# EAGLE design power_pcb (EAGLE 7.5.0)
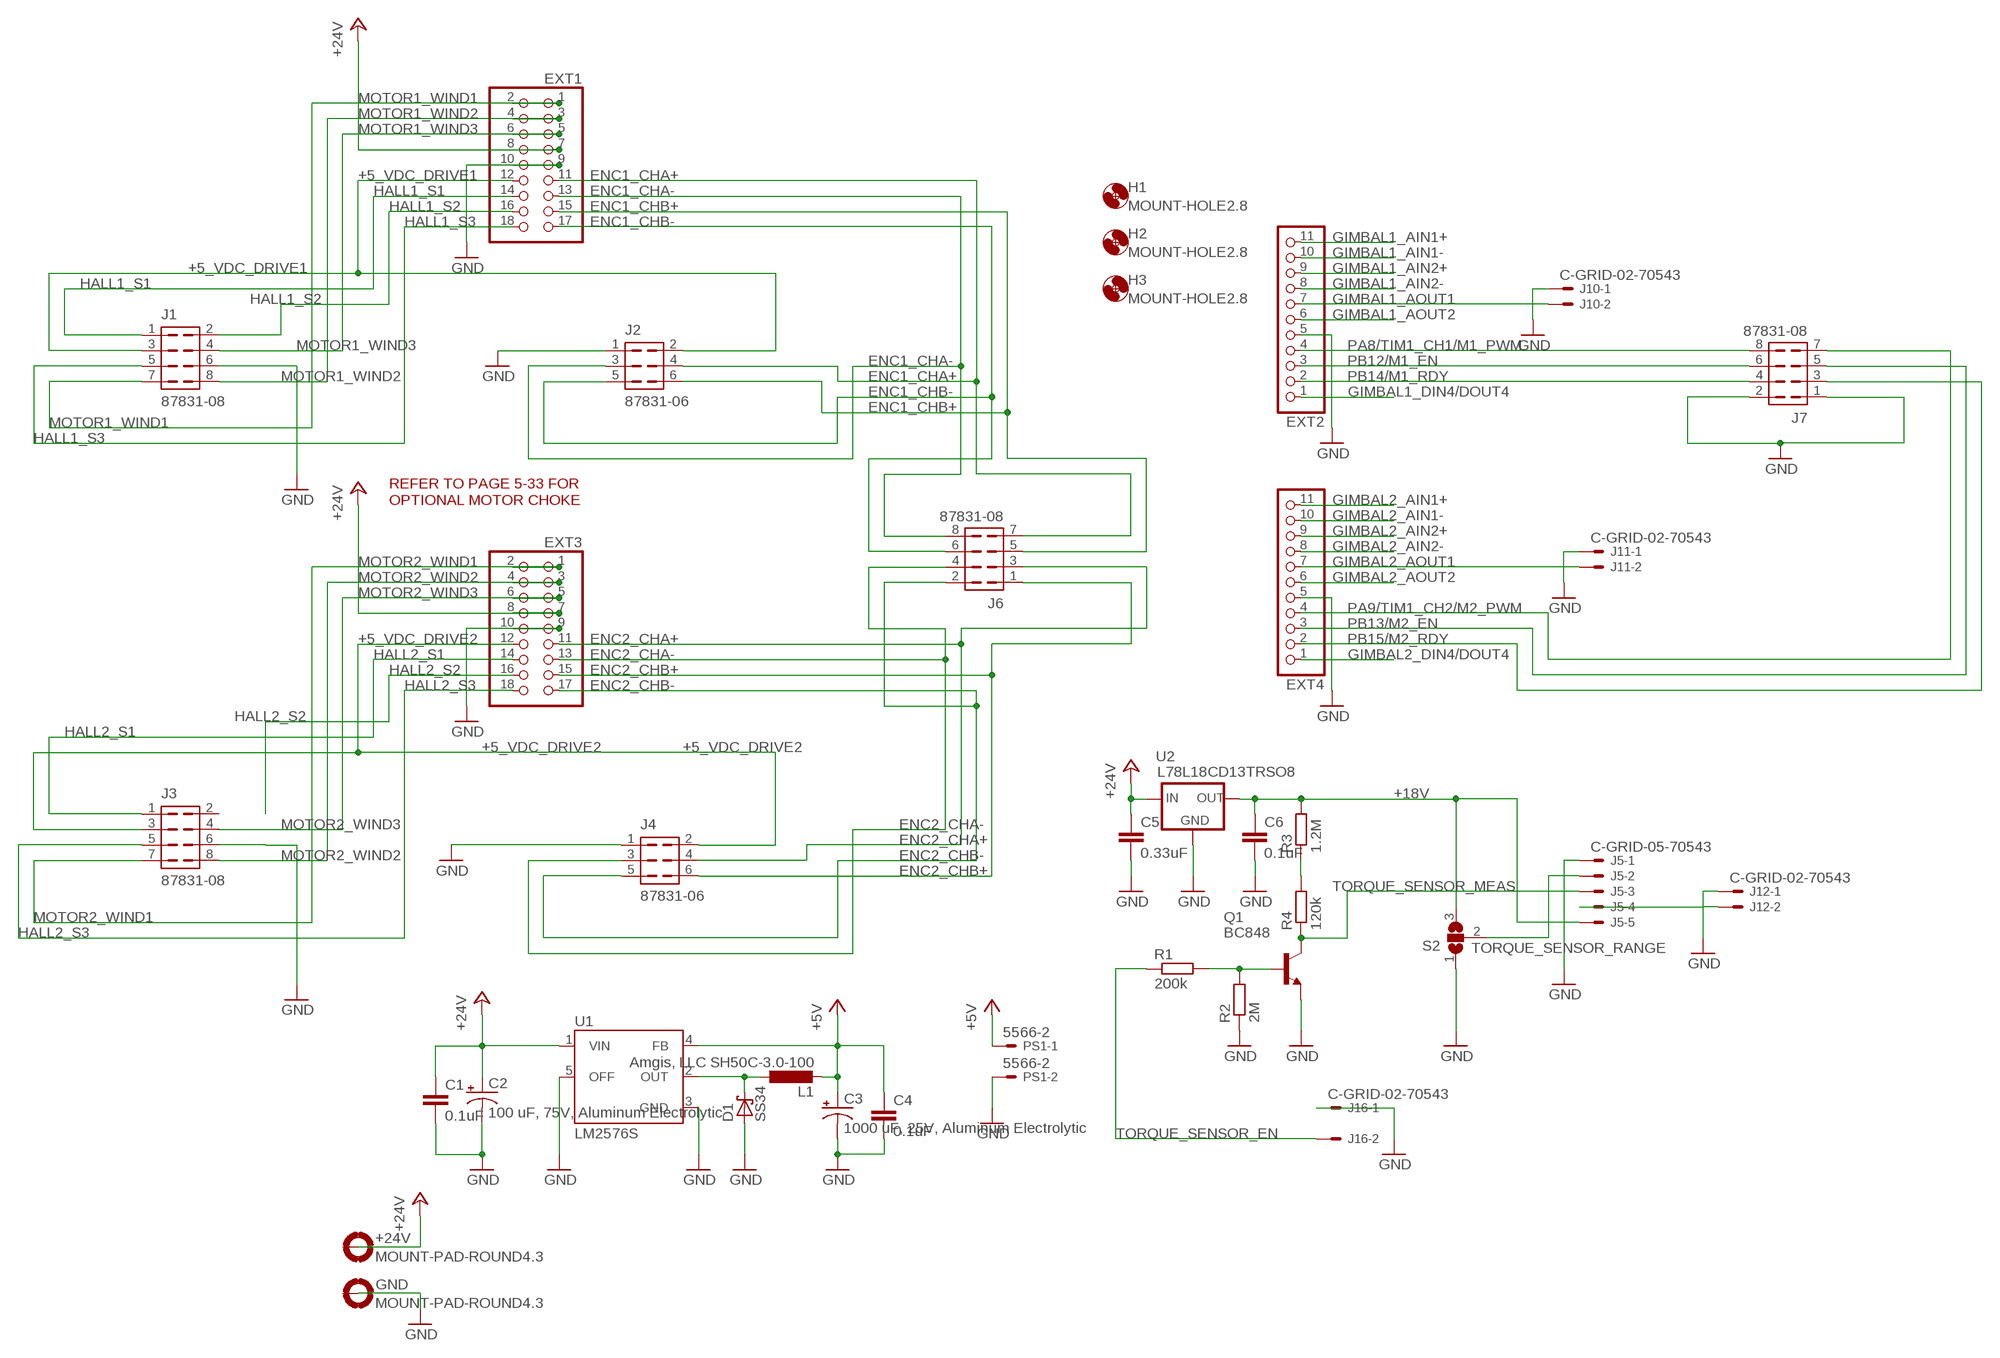
[diagram p0: schematic, sheet 1]

## Parts
+24V  MOUNT-PAD-ROUND4.3  [4,3-PAD]
C1  0.1uF  C-EUC0603  [C0603]
C2  100 uF, 75V, Aluminum Electrolytic  CAP_POLH13  [PANASONIC_H13]
C3  1000 uF, 25V, Aluminum Electrolytic  CAP_POLH13  [PANASONIC_H13]
C4  0.1uF  C-EUC0603  [C0603]
C5  0.33uF  C-EUC0603  [C0603]
C6  0.1uF  C-EUC0603  [C0603]
D1  SS34  SCHOTTKY-DIODESMC  [SMC]
EXT1  PINHD-2X9  [2X09]
EXT2  PINHD-1X11  [1X11]
EXT3  PINHD-2X9  [2X09]
EXT4  PINHD-1X11  [1X11]
GND  MOUNT-PAD-ROUND4.3  [4,3-PAD]
H1  MOUNT-HOLE2.8  [2,8]
H2  MOUNT-HOLE2.8  [2,8]
H3  MOUNT-HOLE2.8  [2,8]
J1  87831-08  [87831-08]
J2  87831-06  [87831-06]
J3  87831-08  [87831-08]
J4  87831-06  [87831-06]
J5  C-GRID-05-70543  [70543-05]
J6  87831-08  [87831-08]
J7  87831-08  [87831-08]
J10  C-GRID-02-70543  [70543-02]
J11  C-GRID-02-70543  [70543-02]
J12  C-GRID-02-70543  [70543-02]
J16  C-GRID-02-70543  [70543-02]
L1  Amgis, LLC SH50C-3.0-100  SH50CC4  [SH50C-C4]
PS1  5566-2  [5566-2]
Q1  BC848  [SOT23]
R1  200k  R-EU_R0603  [R0603]
R2  2M  R-EU_R0603  [R0603]
R3  1.2M  R-EU_R1210  [R1210]
R4  120k  R-EU_R1210  [R1210]
S2  SJ2W  [SJ_2]
U1  LM2576S  [TO263-5]
U2  L78L18CD13TRSO8  [SO8-VREG]

## Nets
+5_VDC_DRIVE1: EXT1.12 J1.3 J2.2
+5_VDC_DRIVE2: EXT3.12 J3.3 J4.2
+5V: C3.+ C4.1 L1.P$2 PS1.1 U1.4(FB)
+18V: C6.1 J5.5 R3.2 S2.3 U2.1(OUT)
+24V: C1.1 C2.+ C5.1 EXT1.7 EXT1.8 EXT3.7 EXT3.8 U1.1(VIN) U2.8(IN)
ENC1_CHA+: EXT1.11 J2.4 J6.7
ENC1_CHA-: EXT1.13 J2.3 J6.8
ENC1_CHB+: EXT1.15 J2.6 J6.5
ENC1_CHB-: EXT1.17 J2.5 J6.6
ENC2_CHA+: EXT3.11 J4.4 J6.3
ENC2_CHA-: EXT3.13 J4.3 J6.4
ENC2_CHB+: EXT3.15 J4.6 J6.1
ENC2_CHB-: EXT3.17 J4.5 J6.2
GIMBAL1_AIN1+: EXT2.11
GIMBAL1_AIN1-: EXT2.10
GIMBAL1_AIN2+: EXT2.9
GIMBAL1_AIN2-: EXT2.8
GIMBAL1_AOUT1: EXT2.7 J10.2
GIMBAL1_AOUT2: EXT2.6
GIMBAL1_DIN4/DOUT4: EXT2.1
GIMBAL2_AIN1+: EXT4.11
GIMBAL2_AIN1-: EXT4.10
GIMBAL2_AIN2+: EXT4.9
GIMBAL2_AIN2-: EXT4.8
GIMBAL2_AOUT1: EXT4.7 J11.2
GIMBAL2_AOUT2: EXT4.6
GIMBAL2_DIN4/DOUT4: EXT4.1
GND: C1.2 C2.- C3.- C4.2 C5.2 C6.2 D1.A EXT1.9 EXT1.10 EXT2.5 EXT3.9 EXT3.10 EXT4.5 J1.6 J2.1 J3.6 J4.1 J5.1 J7.1 J7.2 J10.1 J11.1 J12.1 J16.1 PS1.2 Q1.2(E) R2.1 S2.1 U1.3(GND) U1.5(OFF) U2.2(GND) U2.3(GND) U2.6(GND) U2.7(GND)
HALL1_S1: EXT1.14 J1.1
HALL1_S2: EXT1.16 J1.2
HALL1_S3: EXT1.18 J1.5
HALL2_S1: EXT3.14 J3.1
HALL2_S2: EXT3.16
HALL2_S3: EXT3.18 J3.5
MOTOR1_WIND1: EXT1.1 EXT1.2 J1.7
MOTOR1_WIND2: EXT1.3 EXT1.4 J1.8
MOTOR1_WIND3: EXT1.5 EXT1.6 J1.4
MOTOR2_WIND1: EXT3.1 EXT3.2 J3.7
MOTOR2_WIND2: EXT3.3 EXT3.4 J3.8
MOTOR2_WIND3: EXT3.5 EXT3.6 J3.4
N$1: J5.4 J12.2
N$30: D1.C L1.P$1 U1.2(OUT)
N$52: R3.1 R4.2
N$54: Q1.1(B) R1.2 R2.2
PA8/TIM1_CH1/M1_PWM: EXT2.4 J7.8
PA9/TIM1_CH2/M2_PWM: EXT4.4 J7.7
PB12/M1_EN: EXT2.3 J7.6
PB13/M2_EN: EXT4.3 J7.5
PB14/M1_RDY: EXT2.2 J7.4
PB15/M2_RDY: EXT4.2 J7.3
TORQUE_SENSOR_EN: J16.2 R1.1
TORQUE_SENSOR_MEAS: J5.3 Q1.3(C) R4.1
TORQUE_SENSOR_RANGE: J5.2 S2.2
Unconnected: +24V.B4,3(MOUNT) GND.B4,3(MOUNT) J3.2

## Notes on the sheet
- REFER TO PAGE 5-33 FOR
  OPTIONAL MOTOR CHOKE

## Library data of the parts
+24V GND = holes:MOUNT-PAD-ROUND: MOUNTING PAD, round
C1 C4-C6 = rcl:C-EU: CAPACITOR, European symbol
C2 C3 = SparkFun-Capacitors:CAP_POL: Capacitor Polarized These are standard SMD and PTH capacitors. Normally 10uF, 47uF, and 100uF in electrolytic and tantalum varieties. Always verify the external diameter of the through hole cap, it varies with capacity, voltage, and manufacturer. The EIA devices should be standard.
D1 = diode:SCHOTTKY-DIODE: Schottky Diode
EXT1 EXT3 = pinhead:PINHD-2X9: PIN HEADER
EXT2 EXT4 = pinhead:PINHD-1X11: PIN HEADER
H1-H3 = holes:MOUNT-HOLE: MOUNTING HOLE with drill center marker
J1 J3 J6 J7 = components:87831-08: Milli-Grid Header 2.00mm (.079") Pitch; OC_FARNELL: unknown; OC_NEWARK: unknown
J2 J4 = components:87831-06: Milli-Grid Header 2.00mm (.079") Pitch; OC_FARNELL: 1756947; OC_NEWARK: unknown
J5 = con-molex:C-GRID-05: CONNECTOR wire to board 2.54 mm (0.100") pitch header; OC_FARNELL: unknown; OC_NEWARK: unknown
J10-J12 J16 = con-molex:C-GRID-02: CONNECTOR wire to board 2.54 mm (0.100") pitch header; OC_FARNELL: unknown; OC_NEWARK: unknown
L1 = components:SH50C: Amgis SH50 Fixed Inductor Toroidal Powdered Iron Core
PS1 = con-molex:5566-2: Mini FIT connector 2 pol Source: http://www.molex.com; OC_FARNELL: 1822072; OC_NEWARK: unknown
Q1 = transistor:BC848: NPN TRANSISTOR
R1-R4 = rcl:R-EU_: RESISTOR, European symbol
S2 = jumper:SJ2W: SMD solder JUMPER
U1 = v-reg-3:LM2576: National Semiconductor <http://www.national.com> 3.0A "Simple Switcher"(c) 52kHz, Vout 1.23-37V (HV: 57V), Vin 40V (HV: 60V), 50µA standby current
U2 = components:L78L18CD13TR: VOLTAGE REGULATOR http://www.mouser.com/ds/2/389/CD00000446-355303.pdf

## Board
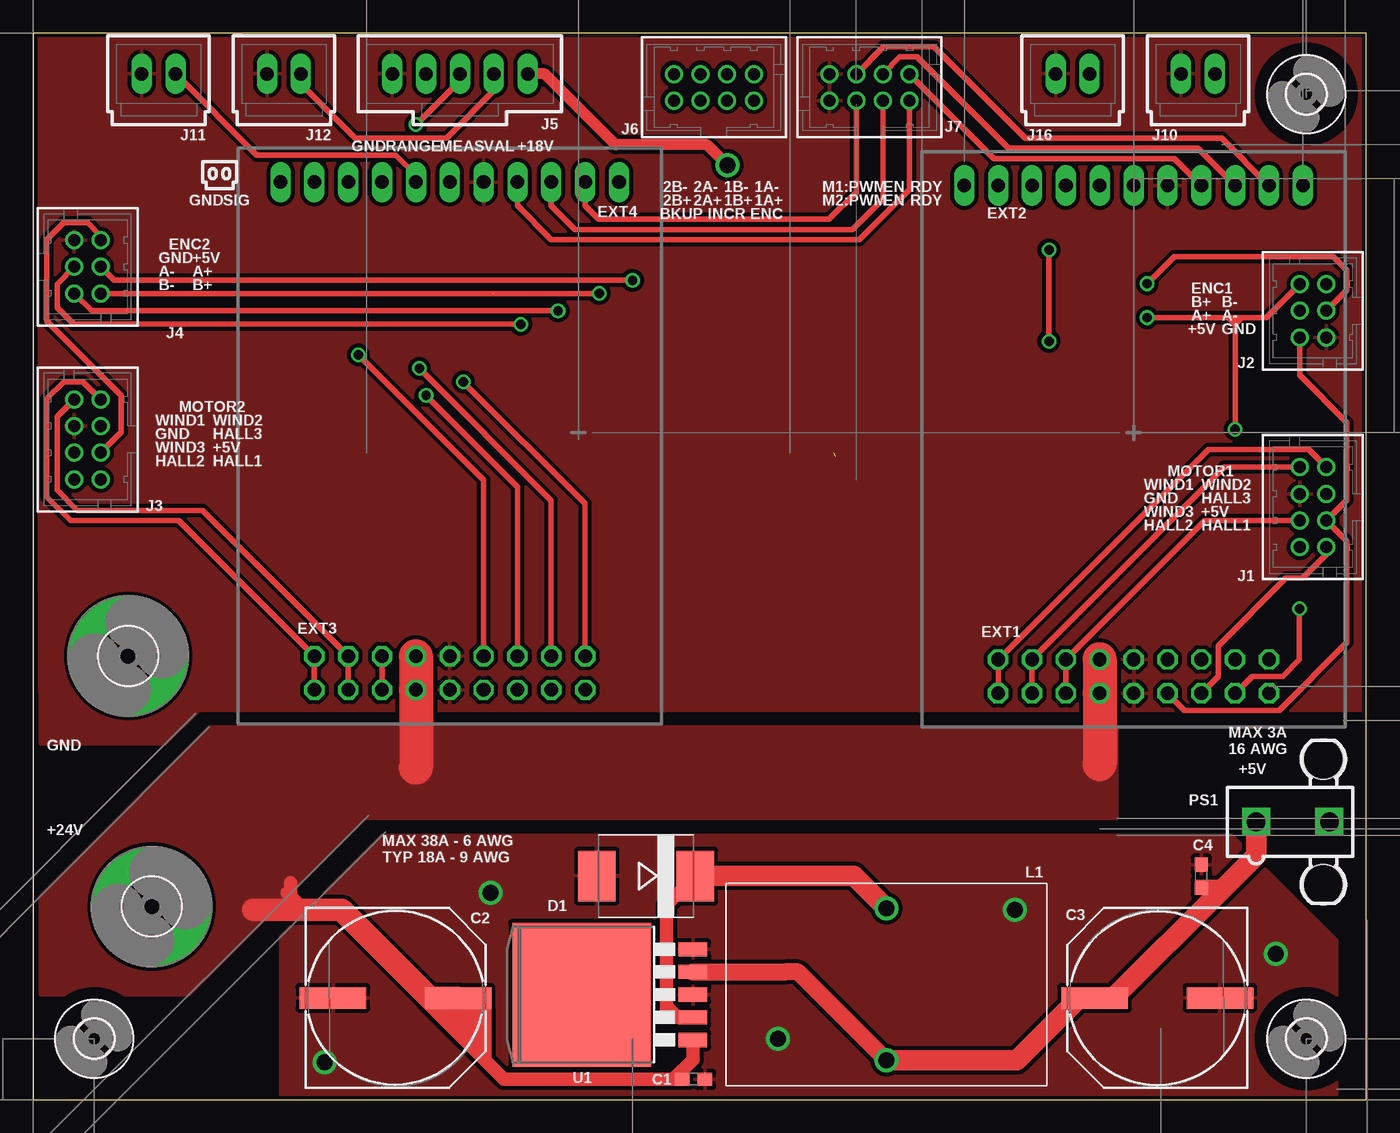
[diagram p1: board, top side]
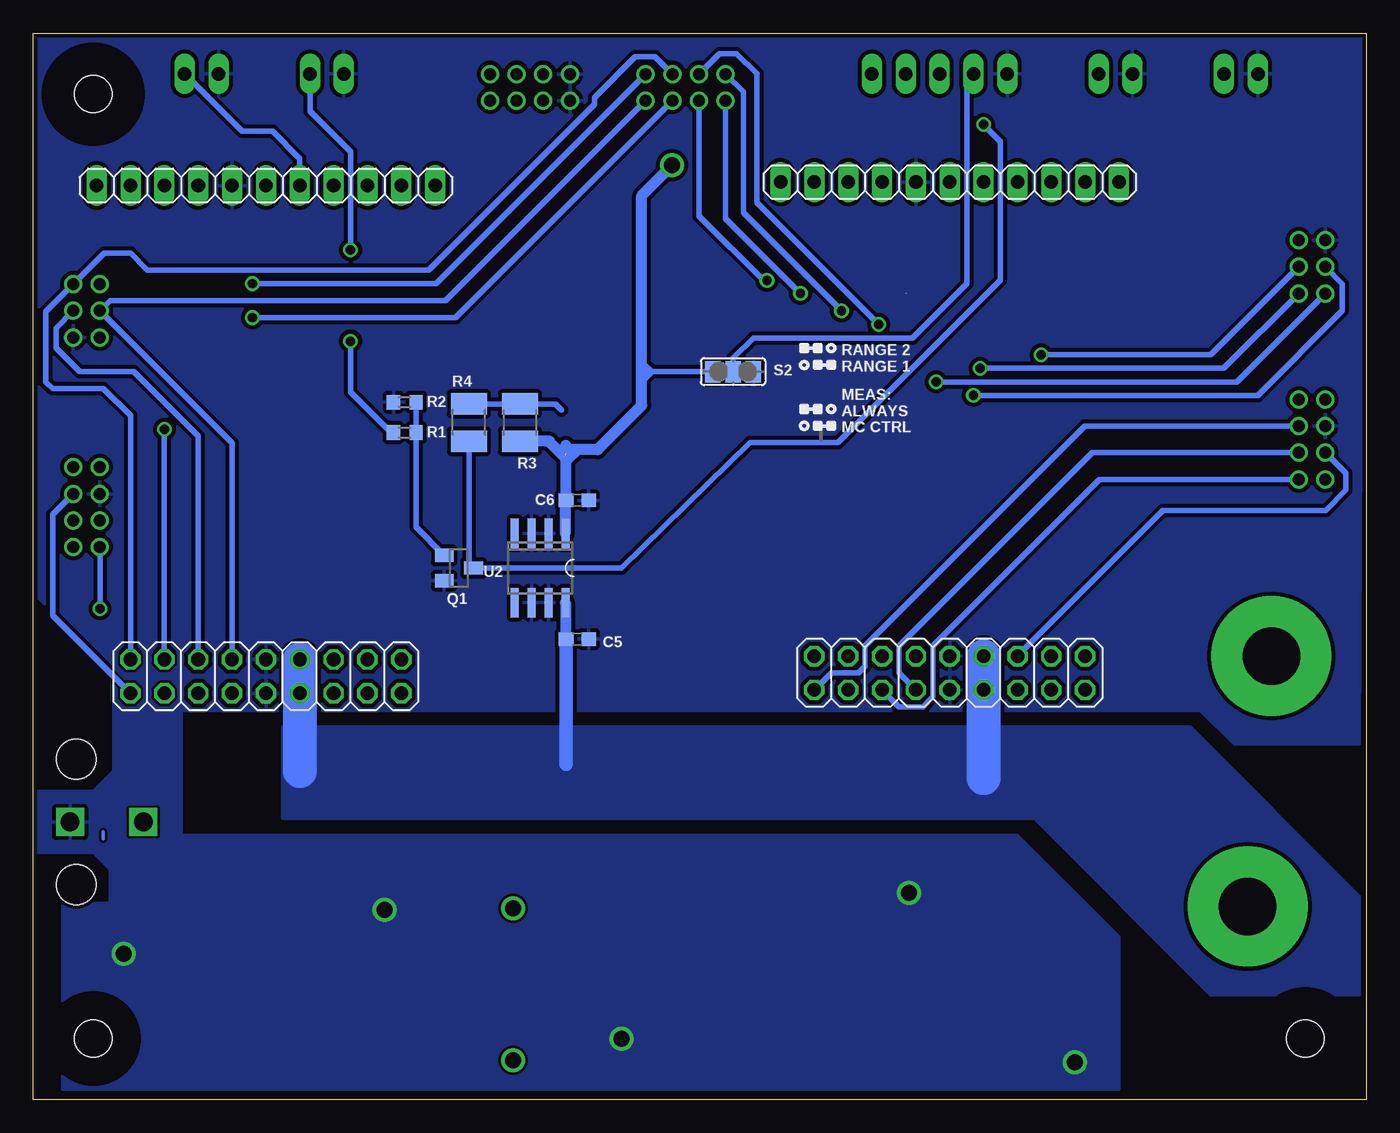
[diagram p2: board, bottom side, seen from below]

Size 100 x 80 mm. Coordinates in mm from the lower left corner, seen from the top.
Outline: 0,0 100,0 100,80 0,80 0,0
Copper layers (1*2+3*4+5*6+7*16): Top 0.035mm / dielectric 0.2mm / layer 2 0.035mm / dielectric 0.15mm / layer 3 0.035mm / dielectric 0.2mm / layer 4 0.035mm / dielectric 0.15mm / layer 5 0.035mm / dielectric 0.2mm / layer 6 0.035mm / dielectric 0.15mm / layer 7 0.035mm / dielectric 0.2mm / Bottom 0.035mm
Design rules "Eagle_WEdirekt_192_check *": minimum track width 0.192mm, minimum drill 0.2mm, track to track 0.192mm, track to pad 0.192mm, pad to pad 0.192mm, via to via 0.192mm, smd to smd 0.192mm, copper to edge 0.3mm, drill to drill 0.6mm, minimum pad ring 0.225mm, minimum via ring 0.2mm, stop-mask expansion 0.075mm, vias tented up to drill 0mil, thermal gap 0.3mm

### Footprints (pad centres in the part's own frame; a part is rotated, then mirrored left to right if it is on the bottom)
4,3-PAD = drill 4.3 pad 9: B4,3 0,0
C0603 = smd 1.1 x 1: 1 -0.85,0; 2 0.85,0
PANASONIC_H13 = smd 5 x 1.6: + 4.7,0; - -4.7,0
SMC = smd 2.8 x 3.8: A 3.7,0; C -3.7,0
2X09 = drill 1.016 octagon: 1 -10.16,-1.27; 2 -10.16,1.27; 3 -7.62,-1.27; 4 -7.62,1.27; 5 -5.08,-1.27; 6 -5.08,1.27; 7 -2.54,-1.27; 8 -2.54,1.27; 9 0,-1.27; 10 0,1.27; 11 2.54,-1.27; 12 2.54,1.27; 13 5.08,-1.27; 14 5.08,1.27; 15 7.62,-1.27; 16 7.62,1.27; 17 10.16,-1.27; 18 10.16,1.27
1X11 = drill 1.016 long: 1 -12.7,0; 2 -10.16,0; 3 -7.62,0; 4 -5.08,0; 5 -2.54,0; 6 0,0; 7 2.54,0; 8 5.08,0; 9 7.62,0; 10 10.16,0; 11 12.7,0
2,8 = hole 2.8: 0,0
87831-08 = drill 0.9: 1 -3,-1; 2 -3,1; 3 -1,-1; 4 -1,1; 5 1,-1; 6 1,1; 7 3,-1; 8 3,1
87831-06 = drill 0.9: 1 -2,-1; 2 -2,1; 3 0,-1; 4 0,1; 5 2,-1; 6 2,1
70543-05 = drill 1.016 long: 1 -5.08,0; 2 -2.54,0; 3 0,0; 4 2.54,0; 5 5.08,0
70543-02 = drill 1.016 long: 1 -1.27,0; 2 1.27,0
SH50C-C4 = drill 1.2 pad 1.8: P$1 0,5.7; P$2 0,-5.7
5566-2 = drill 1.4 square: 1 0,-2.75; 2 0,2.75 | hole 3: 4.7,2.29; -4.7,2.29
SOT23 = smd 1 x 1.4: 1 -0.95,-1.1; 2 0.95,-1.1; 3 0,1.1
R0603 = smd 1 x 1.1: 1 -0.85,0; 2 0.85,0
R1210 = smd 1.6 x 2.7: 1 -1.4,0; 2 1.4,0
SJ_2 = smd 1.168 x 1.6: 1 -1.524,0; 2 0,0; 3 1.524,0
TO263-5 = smd 1.067 x 2.159: 1 -3.404,-5.791; 2 -1.702,-5.791; 3 0,-5.791; 4 1.702,-5.791; 5 3.404,-5.791 | smd 10.8 x 10.41: 6 0,2.54
SO8-VREG = smd 0.6 x 2.2: 1 -1.905,-2.6; 2 -0.635,-2.6; 3 0.635,-2.6; 4 1.905,-2.6; 5 1.905,2.6; 6 0.635,2.6; 7 -0.635,2.6; 8 -1.905,2.6

### Placement (x,y rotation side)
+24V  8.89,14.48 0 top
C1  49.53,1.52 0 top
C2  27.18,7.62 0 top
C3  84.33,7.62 180 top
C4  87.63,16.76 90 top
C5  59.18,34.54 0 bottom
C6  59.18,44.96 0 bottom
D1  45.97,16.76 180 top
EXT1  82.55,31.75 180 bottom
EXT2  82.55,68.58 0 bottom
EXT3  31.24,32 180 bottom
EXT4  31.24,68.83 0 bottom
GND  7.11,33.27 0 top
H1  4.57,4.57 0 top
H2  95.5,4.57 0 top
H3  95.5,75.44 0 top
J1  96.01,44.45 90 top
J2  96.01,59.18 90 top
J3  4.06,49.53 90 top
J4  4.06,62.48 270 top
J5  32,76.96 0 top
J6  51.05,75.95 0 top
J7  62.74,75.95 0 top
J10  87.38,76.96 0 top
J11  9.4,76.96 0 top
J12  18.8,76.96 0 top
J16  77.98,76.96 0 top
L1  64.01,8.64 0 top
PS1  94.49,20.83 270 top
Q1  68.07,39.88 270 bottom
R1  72.14,50.04 0 bottom
R2  72.14,52.32 0 bottom
R3  63.5,50.8 270 bottom
R4  67.31,50.8 90 bottom
S2  47.5,54.61 180 bottom
U1  43.69,7.87 90 top
U2  61.98,39.88 180 bottom

### Tracks (layer width: path | path; a pad name or v marks a point on that pad's centre or on a via)
+5_VDC_DRIVE1
  Top 0.406: J2.2 95.01,54.34 98.55,50.8 98.55,44.99 J1.3 98.55,41.91 98.55,39.88 98.55,39.37 98.55,34.29 93.47,29.21 86.36,29.21 EXT1.12
+5_VDC_DRIVE2
  Top 0.406: J3.3 6.6,50.07 6.6,52.83 1.02,58.42 1.02,64.52 2.29,65.79 4.06,65.79 5.06,64.79 J4.2
  Bottom 0.406: J3.3 20.56,48.53 35.05,34.04 35.05,32 EXT3.12
+5V
  Top 1.016: C4.1 87.72,16 88.9,16 89.15,15.75
  Top 1.27: U1.4 56.39,9.58 57.37,9.58 L1.P$2
  Top 1.524: PS1.1 91.74,18.33 89.15,15.75 81.03,7.62 C3.+ 78.49,7.62 73.8,2.94 L1.P$2
+18V  (via drill 1.2)  (1 unrouted)
  Top 0.813: v52.07,70.1 50.55,71.63 43.69,71.63 38.35,76.96 J5.5
  Bottom 0.254: 61.34,49.4 61.47,49.4
  Bottom 0.406: S2.3 53.59,54.61 | 53.59,54.61 54.1,54.61 54.36,54.86 | 53.59,54.61 54.1,54.1 | 53.59,54.61 54.1,55.12
  Bottom 0.813: 61.24,49.4 61.47,49.4 R3.2 | U2.1 60.07,44.92 C6.1 60.03,48.51 | 60.03,48.51 60.03,49.09 | 59.18,48.77 57.66,48.77 54.36,52.07 54.36,54.86 54.36,67.82 v52.07,70.1 | 59.18,48.77 59.78,48.77 60.03,48.51 | 59.18,48.77 59.94,48.01 | 60.2,48.26 61.34,49.4 62.36,49.4
+24V
  Top 1.016: U1.1 49.48,3 48.01,1.52 | 48.01,1.52 35.31,1.52 31.88,4.95 | C1.1 48.01,1.52 | 31.88,4.95 C2.+ | 31.88,4.95 29.46,7.37 30.48,7.37 31.5,6.35 | 19.05,15.49 20.07,14.48 | 19.3,16.26 19.3,14.73 | 32.77,7.11 32.77,4.83 | 32.77,4.83 32.77,4.57 33.53,3.81 33.53,7.11 33.9,6.74 33.9,3 | 31.88,4.95 32.64,4.95 32.77,4.83
  Top 1.676: 31.24,7.62 C2.+ 29.72,7.62 23.11,14.22 16.51,14.22
  Top 2.54: 80.01,25.15 EXT1.8 EXT1.7 | 28.7,24.89 EXT3.8 EXT3.7
  Bottom 0.254: 60.07,33.57 60.07,34.51 C5.1
  Bottom 0.813: U2.8 60.07,33.57
  Bottom 1.016: C5.1 60.03,25.15
  Bottom 2.54: EXT1.7 80.01,24.64 | EXT3.7 28.7,24.13
  pour Top (isolate 0.305): 0.51,15.24 13.21,27.94 81.28,27.94 81.28,21.08 24.89,21.08 11.68,7.87 0.51,7.87
  pour Bottom (isolate 0.305): 0.51,15.24 13.21,27.94 81.28,27.94 81.28,21.08 24.89,21.08 11.68,7.87 0.51,7.87
ENC1_CHA+
  Bottom 0.406: EXT1.11 85.09,49.26 J2.4 94.25,59.94 69.06,59.94 J6.7
ENC1_CHA-  (via drill 0.7)
  Top 0.406: J2.3 98.55,60.72 98.55,62.23 97.54,63.25 85.6,63.25 v83.57,61.21
  Bottom 0.406: EXT1.13 87.63,49.78 92.46,54.61 96.52,54.61 98.3,56.39 98.3,57.9 J2.3 | J6.8 69.79,61.21 v83.57,61.21
ENC1_CHB+  (via drill 0.7)
  Top 0.406: v83.57,58.67 89.66,58.67 | 89.66,58.67 90.17,58.67 | 90.17,58.67 90.68,58.67 | 90.68,58.67 92.5,58.67 J2.6 | v90.17,50.29 90.17,58.17 | 90.17,58.17 90.17,58.67 | 89.66,58.67 90.17,58.17 | 90.68,58.67 90.17,58.17
  Bottom 0.406: EXT1.15 v90.17,50.29 | J6.5 68.33,58.67 v83.57,58.67
ENC1_CHB-
  Bottom 0.406: EXT1.17 92.71,51.31 94.74,53.34 98.55,53.34 99.06,53.85 99.06,59.13 J2.5 94.69,63.5 92.71,63.5 91.44,62.23 70.36,62.23 57.91,74.68 57.91,75.18 54.86,78.23 53.34,78.23 J6.6
ENC2_CHA+  (via drill 0.7)
  Top 0.406: EXT3.11 33.78,46.48 v24.38,55.88 | v44.96,61.47 6.08,61.47 J4.4
  Bottom 0.406: J4.4 11.67,55.88 v24.38,55.88 | J6.3 50.05,66.82 50.04,66.8 50.04,66.29 45.21,61.47 v44.96,61.47
ENC2_CHA-  (via drill 0.7)
  Top 0.406: EXT3.13 36.32,45.97 v29.46,52.83 | v36.58,58.17 3.05,58.17 1.78,59.44 1.78,61.2 J4.3
  Bottom 0.406: J4.3 1.78,61.2 1.78,59.18 8.13,52.83 v29.46,52.83 | J6.4 48.51,78.49 47.24,78.49 45.72,76.96 45.72,67.31 v36.58,58.17
ENC2_CHB+  (via drill 0.7)  (1 unrouted)
  Top 0.406: EXT3.15 38.86,44.96 v28.96,54.86 | J4.6 34.51,60.48 | v42.45,60.48 34.54,60.48
  Bottom 0.406: J4.6 10.68,54.86 v28.96,54.86 | J6.1 48.05,66.09 v42.45,60.48
ENC2_CHB-  (via drill 0.7)
  Top 0.406: EXT3.17 41.4,44.7 v32.26,53.85 | v39.37,59.18 4.37,59.18 J4.5
  Bottom 0.406: J4.5 9.7,53.85 v32.26,53.85 | J6.2 46.74,75.63 46.74,66.55 v39.37,59.18
GIMBAL1_AOUT1
  Bottom 0.406: EXT2.7 80.01,70.61 82.04,72.64 84.33,72.64 J10.2
GIMBAL2_AOUT1
  Top 0.406: EXT4.7 28.7,69.34 27.18,70.87 16.76,70.87 J11.2
GND  (via drill 1.2)
  other vias: 21.84,2.79 55.88,4.57 73.66,14.22 93.22,10.92 34.29,15.49
  pour Bottom (isolate 0.305): 0.25,79.76 99.57,79.76 99.57,37.59 93.98,32 93.98,29.21 12.45,29.21 9.91,26.67 0.51,26.67
  pour Top (isolate 0.305): 0.25,79.76 99.57,79.76 99.82,29.21 12.45,29.21 9.91,26.67 0.51,26.67
  pour Bottom: 26.16,19.81 18.54,12.19 18.54,0.76 97.79,0.76 97.79,14.73 94.23,14.73 94.23,19.81
  pour Top (isolate 0.305): 26.16,19.81 89.92,19.81 97.79,11.94 97.79,0 18.54,0 18.54,12.19
  pour Bottom: 88.9,33.53 88.9,11.43 94.23,11.43 94.23,17.27 95.5,18.54 99.82,18.54 99.82,23.11 95.5,23.11 93.98,24.64 93.98,33.53
HALL1_S1
  Top 0.406: EXT1.14 88.9,31.75 88.9,34.04 93.98,39.12 95.25,39.12 96.9,40.77 97.01,40.88 | 97.01,40.88 97.03,40.89 | J1.1 97.01,40.88
HALL1_S2  (via drill 0.7)
  Top 0.406: EXT1.16 91.44,31.75 93.73,31.75 95,33.02 95,35.31 95,35.56 v95,36.83
  Bottom 0.406: J1.2 95,41.43 v95,36.83
HALL1_S3
  Bottom 0.406: J1.5 98.55,43.91 98.55,36.32 EXT1.18
HALL2_S1
  Bottom 0.406: J3.1 20.02,46.53 32.51,34.04 32.51,30.23 33.27,29.46 35.05,29.46 EXT3.14
HALL2_S3
  Bottom 0.406: J3.5 21.1,50.53 37.59,34.04 37.59,32.51 38.1,32 40.13,32 EXT3.18
MOTOR1_WIND1
  Top 0.406: EXT1.2 EXT1.1 88.14,48.77 95.69,48.77 J1.7
MOTOR1_WIND2
  Top 0.406: EXT1.4 EXT1.3 89.36,47.45 J1.8
MOTOR1_WIND3
  Top 0.406: EXT1.6 EXT1.5 87.9,43.45 J1.4
MOTOR2_WIND1
  Top 0.406: EXT3.2 EXT3.1 10.92,43.43 2.79,43.43 1.02,45.21 1.02,52.58 2.29,53.85 3.75,53.85 J3.7
MOTOR2_WIND2
  Top 0.406: EXT3.3 EXT3.4 23.62,30.48 | 23.62,33.02 EXT3.3 | EXT3.3 12.7,44.2 3.3,44.2 1.78,45.72 1.78,51.24 J3.8
MOTOR2_WIND3
  Top 0.406: EXT3.6 EXT3.5
  Bottom 0.406: EXT3.5 15.24,44.2 3.05,44.2 1.52,45.72 1.52,46.99 J3.4
N$1
  Top 0.406: J12.2 20.07,76.2 24.13,72.14 30.99,72.14 34.54,75.69 J5.4
N$10
  Bottom 0.254: 94.74,20.07 94.74,19.56
N$30
  Top 0.406: 48.51,6.35 47.75,7.11 47.75,6.17
  Top 1.016: U1.2 47.75,6.17 47.5,6.17 47.5,14.59 D1.C 49.17,16.76
  Top 1.524: D1.C 61.58,16.76 L1.P$1
N$52
  Bottom 0.406: 60.39,51.75 60.84,52.2 62.86,52.2 | 62.74,52.32 62.86,52.2 | R4.2 R3.1 62.86,52.2
N$54
  Bottom 0.406: R2.2 R1.2 71.29,45.21 71.29,44.03 71.29,42.94 Q1.1
PA8/TIM1_CH1/M1_PWM
  Top 0.406: J7.8 72.07,70.61 84.84,70.61 85.6,70.61 EXT2.4
PA9/TIM1_CH2/M2_PWM
  Top 0.406: EXT4.4 36.32,67.06 38.86,64.52 61.98,64.52 65.74,68.28 J7.7
PB12/M1_EN
  Top 0.406: J7.6 65.02,78.23 66.29,78.23 73.15,71.37 87.38,71.37 EXT2.3
PB13/M2_EN
  Top 0.406: J7.5 63.74,67.55 61.47,65.28 40.64,65.28 38.86,67.06 EXT4.3
PB14/M1_RDY
  Top 0.406: EXT2.2 89.15,72.14 74.42,72.14 67.56,78.99 63.79,78.99 J7.4
PB15/M2_RDY
  Top 0.406: EXT4.2 41.4,67.06 42.42,66.04 59.69,66.04 61.74,68.09 J7.3
TORQUE_SENSOR_EN  (via drill 0.7)
  Top 0.406: v76.2,56.9 v76.2,63.75
  Bottom 0.406: J16.2 79.25,74.17 76.2,71.12 v76.2,63.75 | R1.1 73.15,50.04 76.2,53.09 v76.2,56.9
TORQUE_SENSOR_MEAS  (via drill 0.7)
  Top 0.406: J5.3 32,76.45 v28.7,73.15
  Bottom 0.406: v28.7,73.15 27.43,71.88 27.43,61.47 39.62,49.28 46.23,49.28 55.88,39.88 Q1.3 67.31,40.22 R4.1
TORQUE_SENSOR_RANGE
  Bottom 0.406: S2.2 47.5,55.63 45.97,57.15 34.04,57.15 29.97,61.21 29.97,76.45 J5.2

### Text on the board
tPlace: GND | RANGE | MEAS | VAL | +18V | 2B- | 2A- | 1B- | 1A- | M1:PWM | EN | RDY | GND | SIG | 2B+ | 2A+ | 1B+ | 1A+ | M2:PWM | EN | RDY | BKUP INCR ENC | ENC2 | GND | +5V | A- | A+ | B- | B+ | ENC1 | B+ | B- | A+ | A- | +5V | GND | MOTOR2 | WIND1 | WIND2 | GND | HALL3 | WIND3 | +5V | HALL2 | HALL1 | MOTOR1 | WIND1 | WIND2 | GND | HALL3 | WIND3 | +5V | HALL2 | HALL1 | GND | MAX 3A / 16 AWG | +5V | +24V | MAX 38A - 6 AWG / TYP 18A - 9 AWG
bPlace: RANGE 2 / RANGE 1 | MEAS: / ALWAYS / MC CTRL